# Altium schematic sheet PowerSubsystem.SchDoc: Power Subsystem
size Letter; DocumentNumber: 2; Revision: 2; SheetNumber: 2; SheetTotal: 6
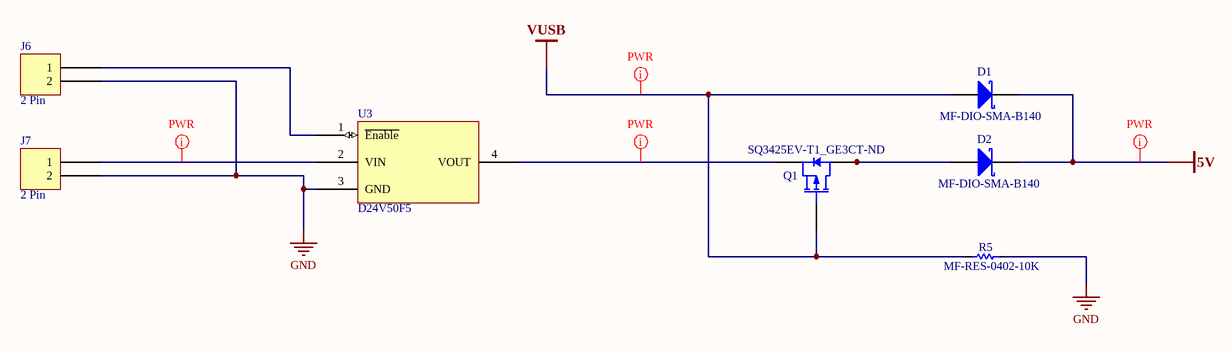
[diagram p0: PowerSubsystem.SchDoc]

## Parts
D1  MF-DIO-SMA-B140  [Diode SMA]
D2  MF-DIO-SMA-B140  [Diode SMA]
J6  2 Pin  [Pinhead_1x2]
J7  2 Pin  [Pinhead_1x2]
Q1  Supplier Part Number 1: SQ3425EV-T1_GE3CT-ND  [TSOP-6_L]  (hidden comment: MOSFET P-CH SOT26 / SOP-6)
R5  MF-RES-0402-10K  [R0402L]
U3  D24V50F5  [D24V50Fx]

## Nets
5V: D1.1(K) D2.1(K)
GND: J6.2 J7.2 R5.2 U3.3(GND)
VUSB: D1.2(A) Q1.3(G) R5.1
NetD2_2: D2.2(A) Q1.1(D) Q1.2(D) Q1.5(D) Q1.6(D)
NetJ6_1: J6.1 U3.1(~{Enable})
NetJ7_1: J7.1 U3.2(VIN)
NetQ1_4: Q1.4(S) U3.4(VOUT)

## Layout directives
net class PWR: 5V, NetJ7_1, NetQ1_4, VUSB

## Notes on the sheet
- Title
- Size:
- Date:
- Letter
- Number:
- Time:
- Revision:
- Sheet
- of
- File:

## Library data of the parts
D1 D2 = Schottky Diode: HOUSEPART: YES; MPN: B140-13-F; POPULATE: 1; Forward Voltage Drop: .5V; Leakage Current (Ir): 10mA; Surge Current: 30A; Peak Reverse Voltage: 40V; URL: https://s3.amazonaws.com/devpublic1/datasheets/ds13002-60388.pdf; MF_PARTNUM: MF-DIO-SMA-B140; Temperature Range: - 65 C to + 150 C; Peak Current: 30A; Supplier 1: Digi-Key; Supplier Part Number 1: B140-FDICT-ND
Q1 = MOSFET P-CH SOT26 / SOP-6: HOUSEPART: NO; MPN: SQ3425EV; POPULATE: YES; Continous Drain Current (Id): 7.4A; Drain-Source Voltage (Vds): 20V; Gate-Source Votlage (Vgs): 12V; Power Dissapation (Pd): 5W; MF_PARTNUM: SQ3425EV-T1_GE3CT-ND; Mounting Technology: SMD; Package Description: TSOP-6; Supplier 1: Digi-Key
R5 = RESISTOR: HOUSEPART: YES; POPULATE: 1; TOLERANCE: 5%; VOLTAGE: 50 V; WATTAGE: 100mW; VALUE: 10K; SymbolName_1: RESISTOR; LibraryName: MF_Passives; DeviceSetName: RESISTOR; MF_PARTNUM: MF-RES-0402-10K
U3 = D24V25Fx: DC Step Down Regulators from Pololu; Current: 5A; Voltage - Min: 38V; Voltage - Max: 6V; Voltage - Output: 5V; Reverse Voltage Protection: YES; Maximum quiescent current: .8mA; POPULATE: 0; Name: D24V50F5; URL: https://www.pololu.com/product/2851